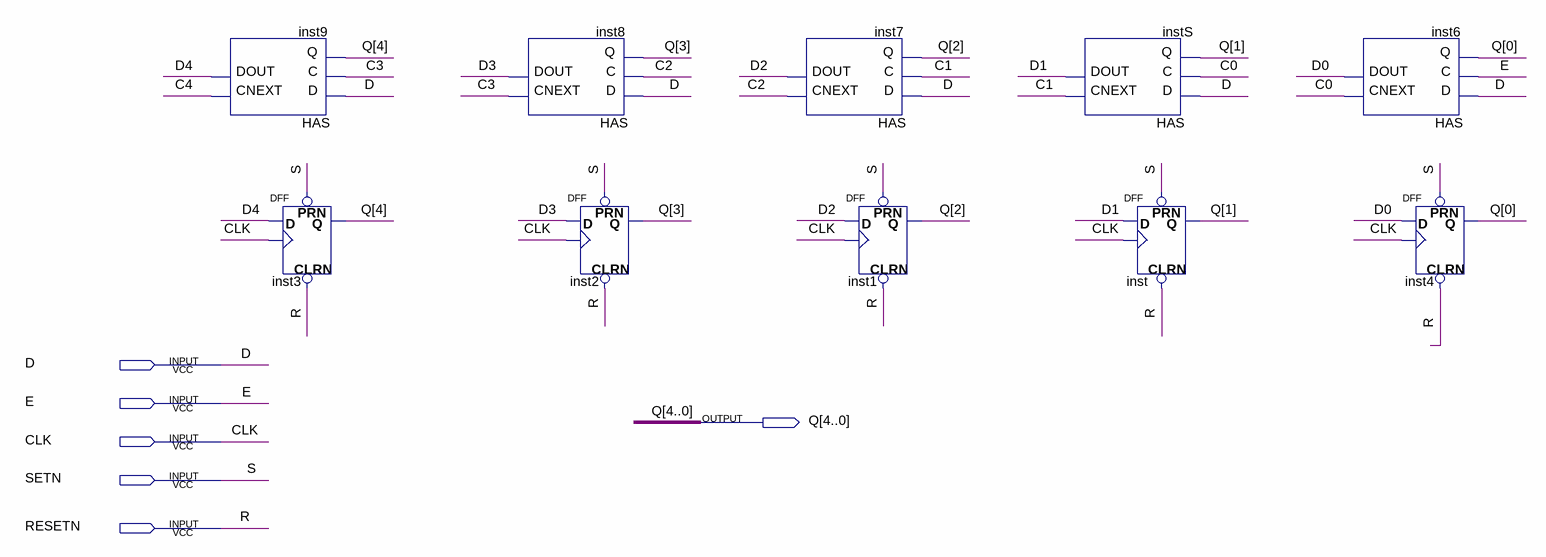
[diagram p0: schematic sheet]
// Quartus schematic COUNTER32_UP_DOWN.bdf as structural Verilog: 10 symbols, 6 pins
module COUNTER32_UP_DOWN (
  input  D,
  input  E,
  input  CLK,
  input  SETN,
  input  RESETN,
  output [4:0] Q
);

  wire C0, C1, C2, C3, C4, D0, D1, D2, D3, D4;

  HAS inst9 (.D(D), .C(C3), .Q(Q[4]), .CNEXT(C4), .DOUT(D4));
  DFF inst3 (.CLRN(RESETN), .CLK(CLK), .D(D4), .PRN(SETN), .Q(Q[4]));
  HAS inst8 (.D(D), .C(C2), .Q(Q[3]), .CNEXT(C3), .DOUT(D3));
  DFF inst2 (.CLRN(RESETN), .CLK(CLK), .D(D3), .PRN(SETN), .Q(Q[3]));
  HAS inst7 (.D(D), .C(C1), .Q(Q[2]), .CNEXT(C2), .DOUT(D2));
  DFF inst1 (.CLRN(RESETN), .CLK(CLK), .D(D2), .PRN(SETN), .Q(Q[2]));
  HAS instS (.D(D), .C(C0), .Q(Q[1]), .CNEXT(C1), .DOUT(D1));
  DFF inst (.CLRN(RESETN), .CLK(CLK), .D(D1), .PRN(SETN), .Q(Q[1]));
  HAS inst6 (.D(D), .C(E), .Q(Q[0]), .CNEXT(C0), .DOUT(D0));
  DFF inst4 (.CLRN(RESETN), .CLK(CLK), .D(D0), .PRN(SETN), .Q(Q[0]));

  // Other names for the same wires on the sheet: R = RESETN; S = SETN
endmodule
